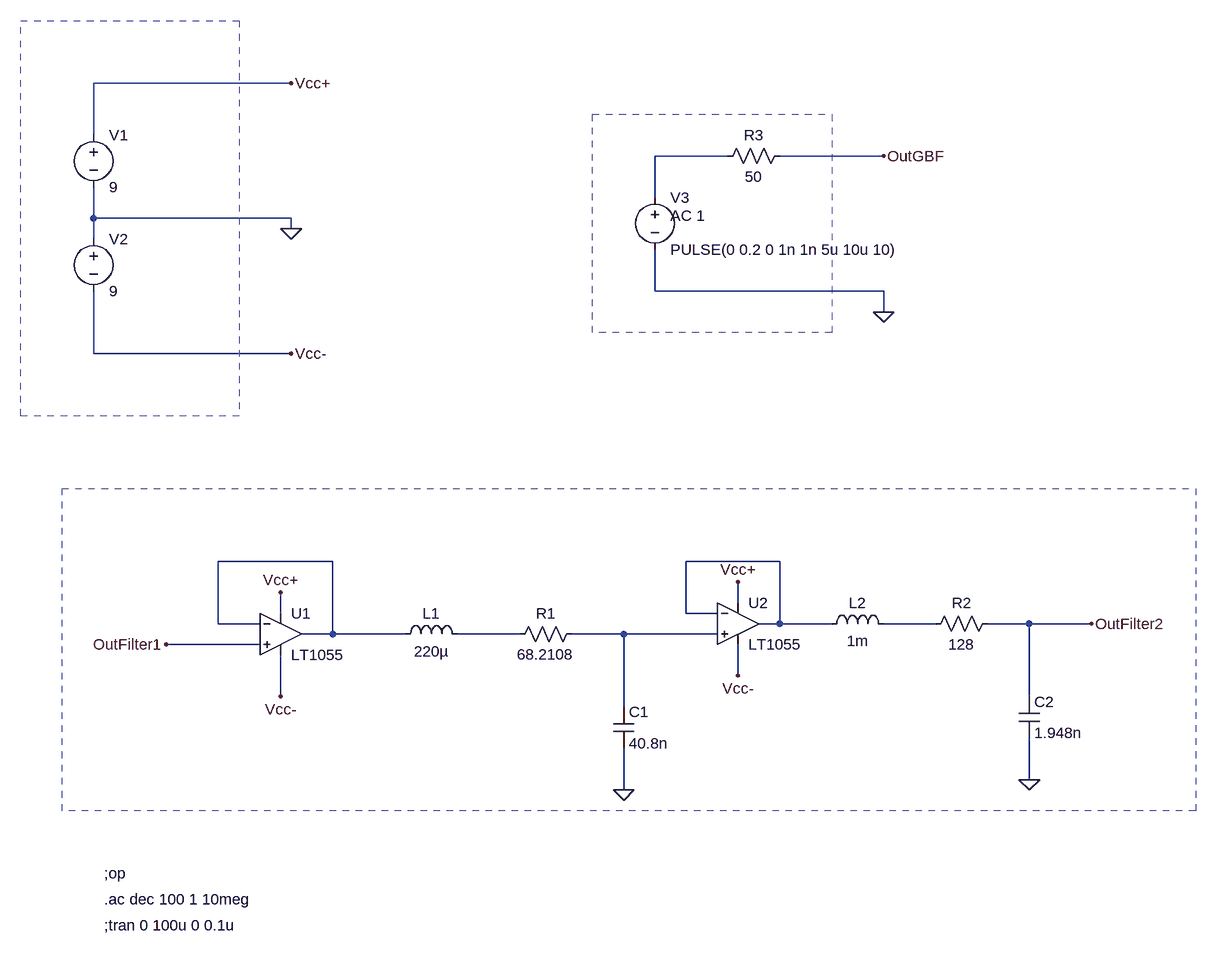
[diagram p0: schematic Draft1.asc]
Draft1.asc, the LTspice schematic file:
Version 4
SHEET 1 1028 680
WIRE -368 -816 -672 -816
WIRE -672 -736 -672 -816
WIRE 304 -704 192 -704
WIRE 544 -704 384 -704
WIRE 192 -640 192 -704
WIRE -672 -608 -672 -656
WIRE -368 -608 -672 -608
WIRE -368 -592 -368 -608
WIRE -672 -576 -672 -608
WIRE 192 -496 192 -560
WIRE 544 -496 192 -496
WIRE 544 -464 544 -496
WIRE -672 -400 -672 -496
WIRE -368 -400 -672 -400
WIRE -304 -80 -480 -80
WIRE 384 -80 240 -80
WIRE 320 -16 320 -48
WIRE -384 0 -384 -32
WIRE 240 0 240 -80
WIRE 288 0 240 0
WIRE -480 16 -480 -80
WIRE -416 16 -480 16
WIRE 384 16 384 -80
WIRE 384 16 352 16
WIRE 464 16 384 16
WIRE 624 16 544 16
WIRE 768 16 704 16
WIRE 864 16 768 16
WIRE -304 32 -304 -80
WIRE -304 32 -352 32
WIRE -192 32 -304 32
WIRE -16 32 -112 32
WIRE 144 32 64 32
WIRE 288 32 144 32
WIRE -416 48 -560 48
WIRE 320 96 320 48
WIRE -384 128 -384 64
WIRE 768 128 768 16
WIRE 144 144 144 32
WIRE 768 256 768 192
WIRE 144 272 144 208
FLAG 768 256 0
FLAG 144 272 0
FLAG -384 128 Vcc-
FLAG 320 96 Vcc-
FLAG 320 -48 Vcc+
FLAG -384 -32 Vcc+
FLAG -560 48 OutFilter1
FLAG 864 16 OutFilter2
FLAG -368 -400 Vcc-
FLAG -368 -816 Vcc+
FLAG -368 -592 0
FLAG 544 -464 0
FLAG 544 -704 OutGBF
SYMBOL ind -208 48 R270
WINDOW 0 32 56 VTop 2
WINDOW 3 5 56 VBottom 2
SYMATTR InstName L1
SYMATTR Value 220µ
SYMBOL res 80 16 R90
WINDOW 0 0 56 VBottom 2
WINDOW 3 32 56 VTop 2
SYMATTR InstName R1
SYMATTR Value 68.2108
SYMBOL cap 128 144 R0
SYMATTR InstName C1
SYMATTR Value 40.8n
SYMBOL cap 752 128 R0
SYMATTR InstName C2
SYMATTR Value 1.948n
SYMBOL res 720 0 R90
WINDOW 0 0 56 VBottom 2
WINDOW 3 32 56 VTop 2
SYMATTR InstName R2
SYMATTR Value 128
SYMBOL ind 448 32 R270
WINDOW 0 32 56 VTop 2
WINDOW 3 5 56 VBottom 2
SYMATTR InstName L2
SYMATTR Value 1m
SYMBOL Opamps\\LT1055 -384 -32 R0
SYMATTR InstName U1
SYMBOL Opamps\\LT1055 320 -48 R0
SYMATTR InstName U2
SYMBOL voltage -672 -752 R0
WINDOW 123 0 0 Left 2
WINDOW 39 0 0 Left 2
SYMATTR InstName V1
SYMATTR Value 9
SYMBOL voltage -672 -592 R0
WINDOW 123 0 0 Left 2
WINDOW 39 0 0 Left 2
SYMATTR InstName V2
SYMATTR Value 9
SYMBOL voltage 192 -656 R0
WINDOW 123 24 44 Left 2
WINDOW 39 0 0 Left 2
SYMATTR InstName V3
SYMATTR Value PULSE(0 0.2 0 1n 1n 5u 10u 10)
SYMATTR Value2 AC 1
SYMBOL res 400 -720 R90
WINDOW 0 0 56 VBottom 2
WINDOW 3 32 56 VTop 2
SYMATTR InstName R3
SYMATTR Value 50
TEXT -656 440 Left 2 !.ac dec 100 1 10meg
TEXT -656 400 Left 2 !;op
TEXT -656 480 Left 2 !;tran 0 100u 0 0.1u
RECTANGLE Normal 1024 304 -720 -192 2
RECTANGLE Normal -448 -304 -784 -912 2
RECTANGLE Normal 464 -432 96 -768 2

The netlist it stands for:
* Draft1.asc
L1 N002 N005 220µ
R1 N006 N005 68.2108
C1 N006 0 40.8n
C2 OutFilter2 0 1.948n
R2 OutFilter2 N004 128
L2 N003 N004 1m
XU1 OutFilter1 N002 Vcc+ Vcc- N002 LT1055  ; pins In+ In- V+ V- OUT
XU2 N006 N003 Vcc+ Vcc- N003 LT1055  ; pins In+ In- V+ V- OUT
V1 Vcc+ 0 9
V2 0 Vcc- 9
V3 N001 0 PULSE(0 0.2 0 1n 1n 5u 10u 10) AC 1
R3 OutGBF N001 50
.ac dec 100 1 10meg
;op
;tran 0 100u 0 0.1u
.backanno
.end